# Altium schematic sheet [07] - Slave_MCU.SchDoc: =ProjectName
size A4; CheckedBy: Ven; Author: Ven; CompanyName: HUST; Revision: V.1.0
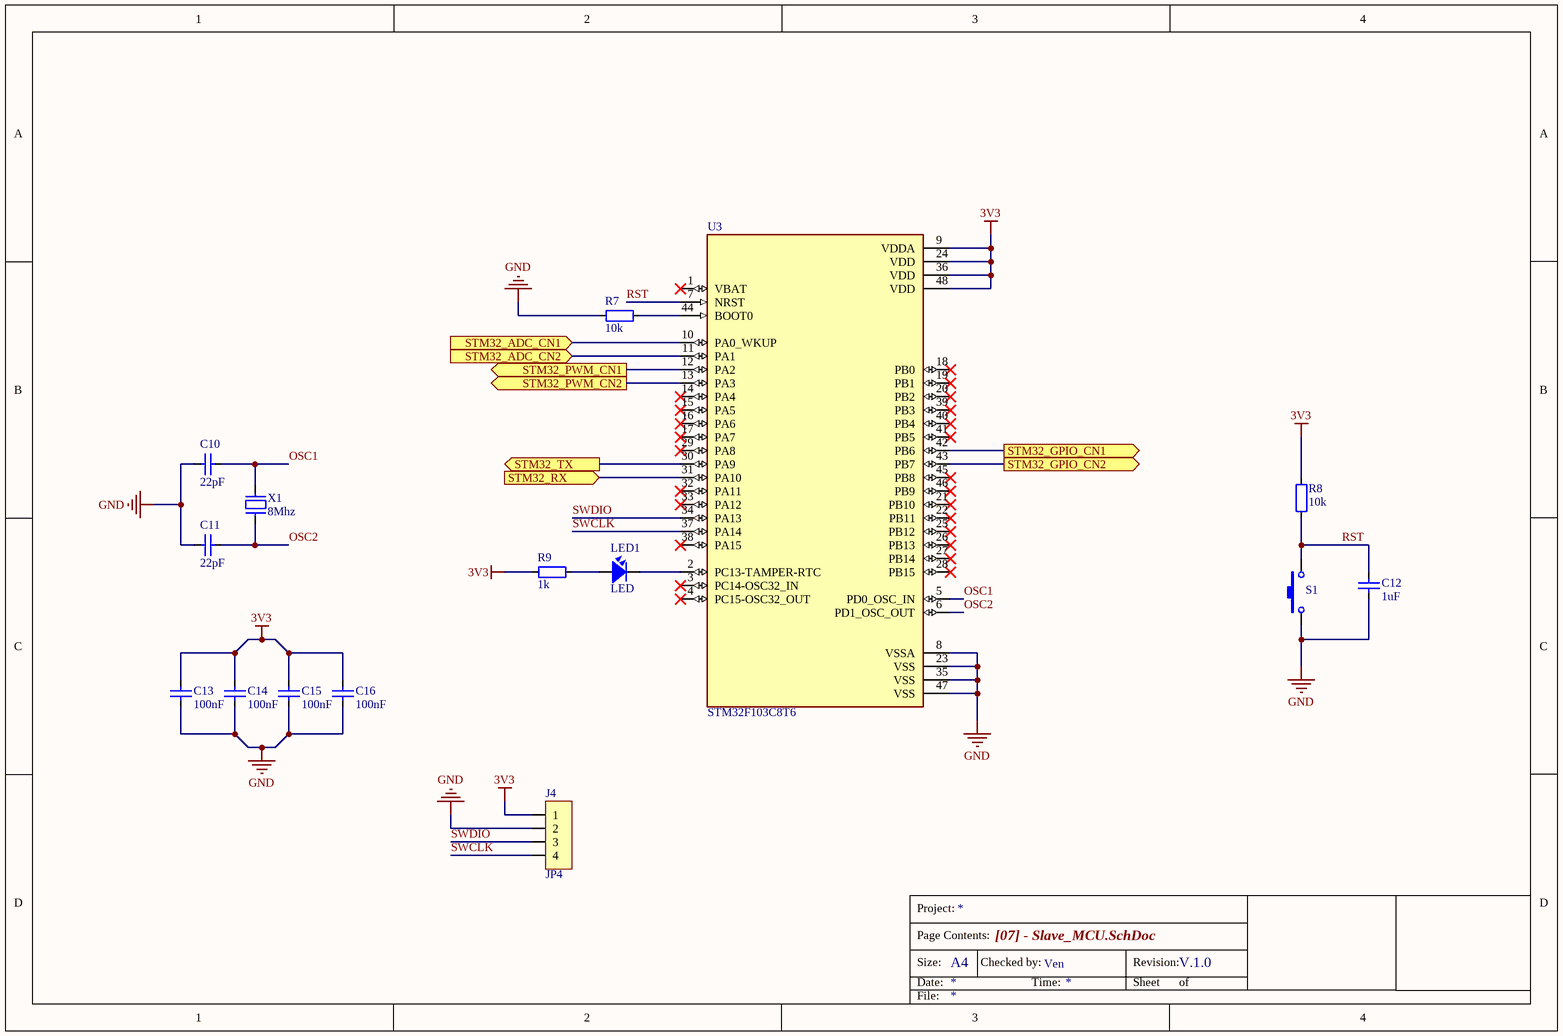
[diagram p0: [07] - Slave_MCU.SchDoc]

## Parts
C10  22pF  [CAP_0805]
C11  22pF  [CAP_0805]
C12  1uF  [CAP_0805]
C13  100nF  [CAP_0805]
C14  100nF  [CAP_0805]
C15  100nF  [CAP_0805]
C16  100nF  [CAP_0805]
J4  JP4  [JP4-C1T]
LED1  LED  [LED-0805-Blue]
R7  10k  [RES-SMD-0805]
R8  10k  [RES-SMD-0805]
R9  1k  [RES-SMD-0805]
S1  SW-SMD  [SW 3x2x4]  (value not drawn)
U3  STM32F103C8T6  [LQFP 48]
X1  8Mhz  [XTAL 5032 SMD]

## Ports
STM32_ADC_CN1 (in), STM32_ADC_CN2 (in), STM32_GPIO_CN1 (out), STM32_GPIO_CN2 (out), STM32_PWM_CN1 (out), STM32_PWM_CN2 (out), STM32_RX (in), STM32_TX (out)

## Nets
3V3: C13.2 C14.2 C15.2 C16.2 J4.1 R8.2 R9.2 U3.9(VDDA) U3.24(VDD) U3.36(VDD) U3.48(VDD)
GND: C10.2 C11.2 C12.1 C13.1 C14.1 C15.1 C16.1 J4.2 R7.2 S1.1 U3.8(VSSA) U3.23(VSS) U3.35(VSS) U3.47(VSS)
OSC1: C10.1 U3.5(PD0_OSC_IN) X1.2
OSC2: C11.1 U3.6(PD1_OSC_OUT) X1.1
RST: C12.2 R8.1 S1.2 U3.7(NRST)
STM32_ADC_CN1: U3.10(PA0_WKUP) ; port STM32_ADC_CN1
STM32_ADC_CN2: U3.11(PA1) ; port STM32_ADC_CN2
STM32_GPIO_CN1: U3.42(PB6) ; port STM32_GPIO_CN1
STM32_GPIO_CN2: U3.43(PB7) ; port STM32_GPIO_CN2
STM32_PWM_CN1: U3.12(PA2) ; port STM32_PWM_CN1
STM32_PWM_CN2: U3.13(PA3) ; port STM32_PWM_CN2
STM32_RX: U3.31(PA10) ; port STM32_RX
STM32_TX: U3.30(PA9) ; port STM32_TX
SWCLK: J4.4 U3.37(PA14)
SWDIO: J4.3 U3.34(PA13)
NetLED1_1: LED1.1 R9.1
NetLED1_2: LED1.2 U3.2(PC13-TAMPER-RTC)
NetR7_1: R7.1 U3.44(BOOT0)

Not connected (* = marked no-connect by the designer): U3 1(VBAT)* 3(PC14-OSC32_IN)* 4(PC15-OSC32_OUT)* 14(PA4)* 15(PA5)* 16(PA6)* 17(PA7)* 18(PB0)* 19(PB1)* 20(PB2)* 21(PB10)* 22(PB11)* 25(PB12)* 26(PB13)* 27(PB14)* 28(PB15)* 29(PA8)* 32(PA11)* 33(PA12)* 38(PA15)* 39(PB3)* 40(PB4)* 41(PB5)* 45(PB8)* 46(PB9)*

## Notes on the sheet
- Project:
- Page Contents:
- Size:
- Date:
- A4
- Checked by:
- Time:
- Revision:
- Sheet
- of
- File:

## Library data of the parts
C10-C16 = CapSMD: Capacitor; Value: 33p; Published: 8-Jun-2000; LatestRevisionDate: 17-Jul-2002; LatestRevisionNote: Re-released for DXP Platform.; PackageReference: RAD-0.3; Publisher: Altium Limited
J4 = JP4: WR-PHD 2.54 mm Angled Socket Header; Manufacturer: W¨¹rth Elektronik eiSos GmbH; partNo: 613004143121; ComponentLink1 Description: Manufacturer; ComponentLink2 Description: Datasheet; NoPins: 04; Created Date: 29 March 2013; ComponentLink1URL: http://www.we-online.com; ComponentLink2URL: http://katalog.we-online.de/em/datasheet/6130xx143121.pdf; Created by: Karrer Zheng
LED1 = LED: LED Single colour Green and Red; Value: LED 3 ly Single Colour
R7-R9 = Resistor - SMD: Resistor; Manufacturer: Generic Components; Class: Passive; Published: 08/06/2000; Publisher: Altium Hobart Technology Centre
S1 = SW-SMD: Switch; Published: 24-Mar-1999; LatestRevisionDate: 17-Jul-2002; LatestRevisionNote: Re-released for DXP Platform.; PackageReference: SPST-2; Publisher: Altium Limited
X1 = XT2: Crystal For all Crystal 2pin.; Value: 4Mhz